# Altium schematic sheet Project_Information.SchDoc: =project_title
size Tabloid; CompanyName: Luxonis Holding; Organization: Luxonis Holding; Address1: 1925 Harmony Park Drive; Address2: Westminster, CO; Address3: 80234; Address4: United States; SheetNumber: 1; SheetTotal: 17
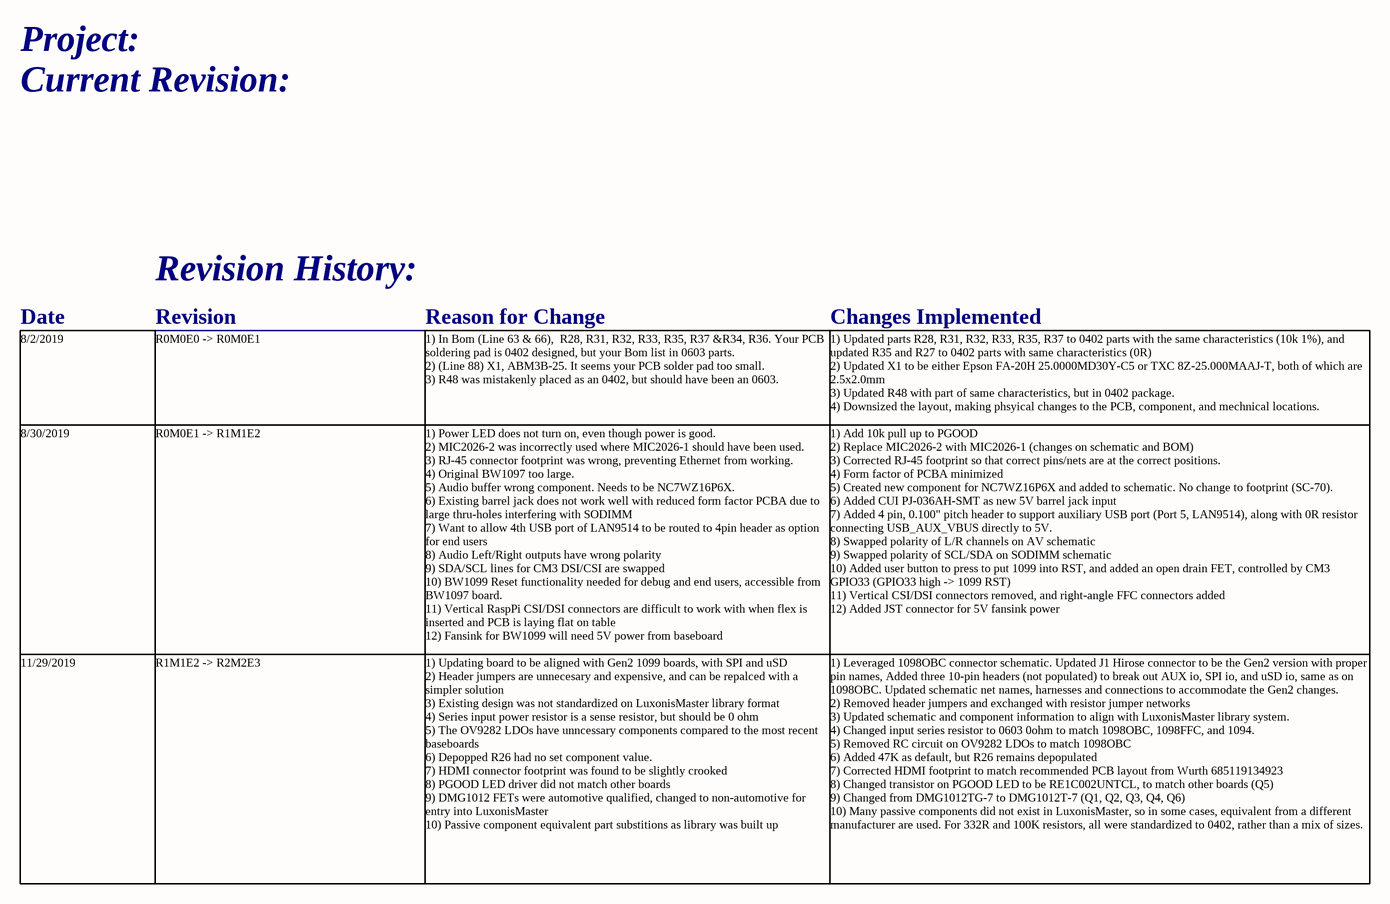
[diagram p0: Project_Information.SchDoc]

## Notes on the sheet
- Project:
- Current Revision:
- Revision History:
- Date
- Revision
- Reason for Change
- Changes Implemented
- 8/2/2019
- R0M0E0 -> R0M0E1
- 1) In Bom (Line 63 & 66),  R28, R31, R32, R33, R35, R37 &R34, R36. Your PCB soldering pad is 0402 designed, but your Bom list in 0603 parts.
  2) (Line 88) X1, ABM3B-25. It seems your PCB solder pad too small.
  3) R48 was mistakenly placed as an 0402, but should have been an 0603.
- 1) Updated parts R28, R31, R32, R33, R35, R37 to 0402 parts with the same characteristics (10k 1%), and updated R35 and R27 to 0402 parts with same characteristics (0R)
  2) Updated X1 to be either Epson FA-20H 25.0000MD30Y-C5 or TXC 8Z-25.000MAAJ-T, both of which are 2.5x2.0mm
  3) Updated R48 with part of same characteristics, but in 0402 package.
  4) Downsized the layout, making phsyical changes to the PCB, component, and mechnical locations.
- 8/30/2019
- R0M0E1 -> R1M1E2
- 1) Power LED does not turn on, even though power is good.
  2) MIC2026-2 was incorrectly used where MIC2026-1 should have been used.
  3) RJ-45 connector footprint was wrong, preventing Ethernet from working.
  4) Original BW1097 too large.
  5) Audio buffer wrong component. Needs to be NC7WZ16P6X.
  6) Existing barrel jack does not work well with reduced form factor PCBA due to large thru-holes interfering with SODIMM
  7) Want to allow 4th USB port of LAN9514 to be routed to 4pin header as option for end users
  8) Audio Left/Right outputs have wrong polarity
  9) SDA/SCL lines for CM3 DSI/CSI are swapped
  10) BW1099 Reset functionality needed for debug and end users, accessible from BW1097 board.
  11) Vertical RaspPi CSI/DSI connectors are difficult to work with when flex is inserted and PCB is laying flat on table
  12) Fansink for BW1099 will need 5V power from baseboard
- 1) Add 10k pull up to PGOOD
  2) Replace MIC2026-2 with MIC2026-1 (changes on schematic and BOM)
  3) Corrected RJ-45 footprint so that correct pins/nets are at the correct positions.
  4) Form factor of PCBA minimized
  5) Created new component for NC7WZ16P6X and added to schematic. No change to footprint (SC-70).
  6) Added CUI PJ-036AH-SMT as new 5V barrel jack input
  7) Added 4 pin, 0.100" pitch header to support auxiliary USB port (Port 5, LAN9514), along with 0R resistor connecting USB_AUX_VBUS directly to 5V.
  8) Swapped polarity of L/R channels on AV schematic
  9) Swapped polarity of SCL/SDA on SODIMM schematic
  10) Added user button to press to put 1099 into RST, and added an open drain FET, controlled by CM3 GPIO33 (GPIO33 high -> 1099 RST)
  11) Vertical CSI/DSI connectors removed, and right-angle FFC connectors added
  12) Added JST connector for 5V fansink power
- 11/29/2019
- R1M1E2 -> R2M2E3
- 1) Updating board to be aligned with Gen2 1099 boards, with SPI and uSD
  2) Header jumpers are unnecesary and expensive, and can be repalced with a simpler solution
  3) Existing design was not standardized on LuxonisMaster library format
  4) Series input power resistor is a sense resistor, but should be 0 ohm
  5) The OV9282 LDOs have unncessary components compared to the most recent baseboards
  6) Depopped R26 had no set component value.
  7) HDMI connector footprint was found to be slightly crooked
  8) PGOOD LED driver did not match other boards
  9) DMG1012 FETs were automotive qualified, changed to non-automotive for entry into LuxonisMaster
  10) Passive component equivalent part substitions as library was built up
- 1) Leveraged 1098OBC connector schematic. Updated J1 Hirose connector to be the Gen2 version with proper pin names, Added three 10-pin headers (not populated) to break out AUX io, SPI io, and uSD io, same as on 1098OBC. Updated schematic net names, harnesses and connections to accommodate the Gen2 changes.
  2) Removed header jumpers and exchanged with resistor jumper networks
  3) Updated schematic and component information to align with LuxonisMaster library system.
  4) Changed input series resistor to 0603 0ohm to match 1098OBC, 1098FFC, and 1094.
  5) Removed RC circuit on OV9282 LDOs to match 1098OBC
  6) Added 47K as default, but R26 remains depopulated
  7) Corrected HDMI footprint to match recommended PCB layout from Wurth 685119134923
  8) Changed transistor on PGOOD LED to be RE1C002UNTCL, to match other boards (Q5)
  9) Changed from DMG1012TG-7 to DMG1012T-7 (Q1, Q2, Q3, Q4, Q6)
  10) Many passive components did not exist in LuxonisMaster, so in some cases, equivalent from a different manufacturer are used. For 332R and 100K resistors, all were standardized to 0402, rather than a mix of sizes.
- Title
- Size:
- Date:
- Tabloid
- Number:
- Time:
- Revision:
- Sheet
- of
- Drawn by: